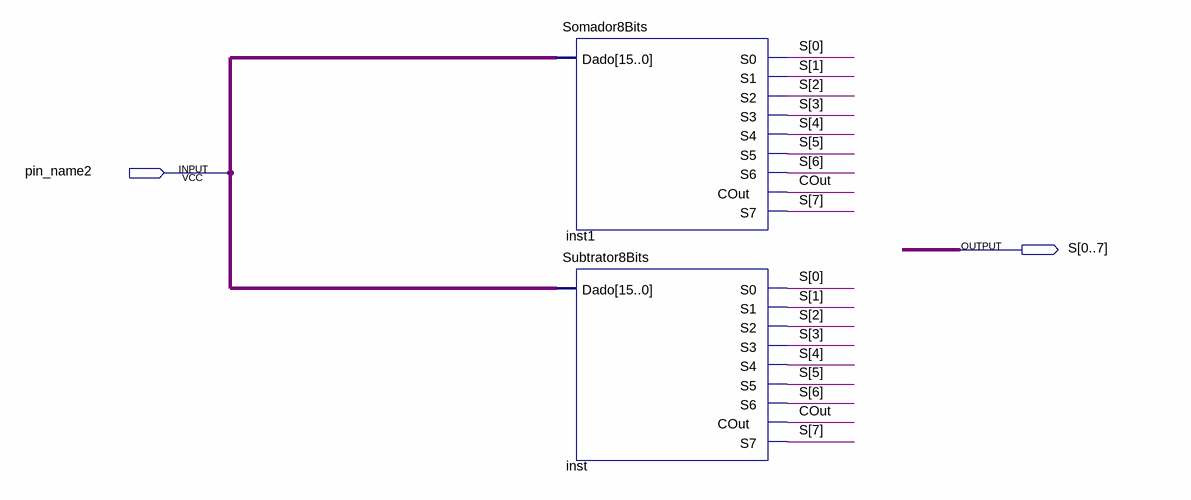
[diagram p0: schematic sheet]
// Quartus schematic SomadorSubtrator.bdf as structural Verilog: 2 symbols, 2 pins
module SomadorSubtrator (
  input  pin_name2,
  output [0:7] S
);

  wire COut;
  wire [15:0] undriven;

  Somador8Bits inst1 (
    .Dado(undriven), .S0(S[0]), .S1(S[1]), .S2(S[2]), .S3(S[3]), .S4(S[4]), .S5(S[5]), .S6(S[6]),
    .COut(COut), .S7(S[7]));
  Subtrator8Bits inst (
    .Dado(undriven), .S0(S[0]), .S1(S[1]), .S2(S[2]), .S3(S[3]), .S4(S[4]), .S5(S[5]), .S6(S[6]),
    .COut(COut), .S7(S[7]));
endmodule
